# EAGLE design micShield (EAGLE 8.7.1)

## Sheet 1 of 2
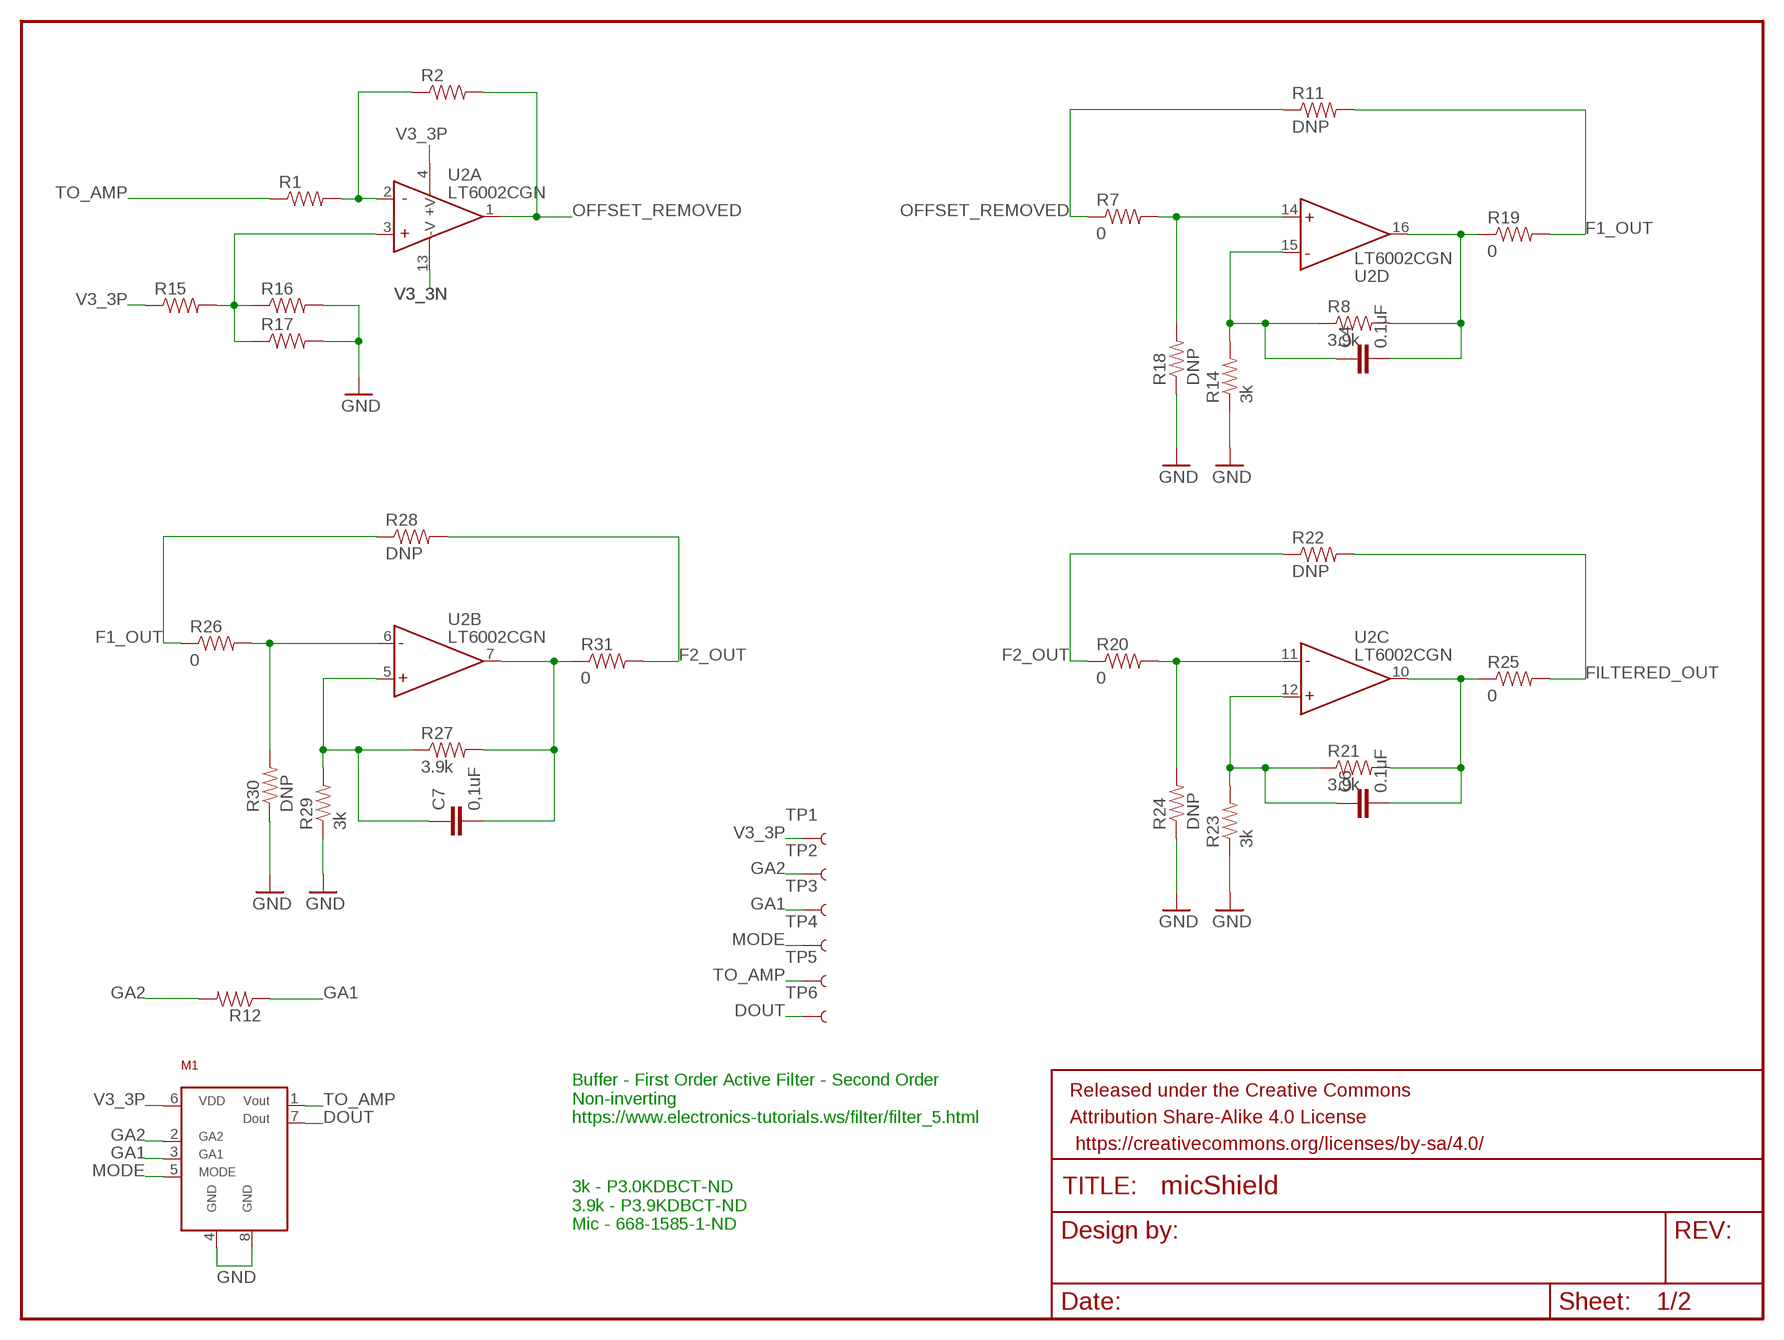
[diagram p0: schematic, sheet 1]

### Parts
C4  0.1uF  CAP0402-CAP  [0402-CAP]
C6  0.1uF  CAP0402-CAP  [0402-CAP]
C7  0,1uF  CAP0402-CAP  [0402-CAP]
FRAME1  FRAME-LETTER  [CREATIVE_COMMONS]
M1  PMM-3738-VM1010-R  [PMM-3738-VM1010-R]
R1  RESISTOR0402  [0402-RES]
R2  RESISTOR0402  [0402-RES]
R7  0  RESISTOR0402  [0402-RES]
R8  3.9k  RESISTOR0402  [0402-RES]
R11  DNP  RESISTOR0402  [0402-RES]
R12  RESISTOR0402  [0402-RES]
R14  3k  RESISTOR0402  [0402-RES]
R15  RESISTOR0402  [0402-RES]
R16  RESISTOR0402  [0402-RES]
R17  RESISTOR0402  [0402-RES]
R18  DNP  RESISTOR0402  [0402-RES]
R19  0  RESISTOR0402  [0402-RES]
R20  0  RESISTOR0402  [0402-RES]
R21  3.9k  RESISTOR0402  [0402-RES]
R22  DNP  RESISTOR0402  [0402-RES]
R23  3k  RESISTOR0402  [0402-RES]
R24  DNP  RESISTOR0402  [0402-RES]
R25  0  RESISTOR0402  [0402-RES]
R26  0  RESISTOR0402  [0402-RES]
R27  3.9k  RESISTOR0402  [0402-RES]
R28  DNP  RESISTOR0402  [0402-RES]
R29  3k  RESISTOR0402  [0402-RES]
R30  DNP  RESISTOR0402  [0402-RES]
R31  0  RESISTOR0402  [0402-RES]
TP1  TEST-POINT3  [PAD.03X.03]
TP2  TEST-POINT3  [PAD.03X.03]
TP3  TEST-POINT3  [PAD.03X.03]
TP4  TEST-POINT3  [PAD.03X.03]
TP5  TEST-POINT3  [PAD.03X.03]
TP6  TEST-POINT3  [PAD.03X.03]
U2  LT6002CGN  [SSOP-16_GN]

### Nets
DOUT: M1.7 TP6.P$1 ; also sheet 2
F1_OUT: R11.2 R19.2 R26.1 R28.1
F2_OUT: R20.1 R22.1 R28.2 R31.2
FILTERED_OUT: R22.2 R25.2 ; also sheet 2
GA1: M1.3 R12.1 TP3.P$1
GA2: M1.2 R12.2 TP2.P$1
GND: M1.4 M1.8 R14.1 R16.2 R17.2 R18.1 R23.1 R24.1 R29.1 R30.1 ; also sheet 2
MODE: M1.5 TP4.P$1 ; also sheet 2
N$1: R1.2 R2.1 U2.2(A:-IN)
N$6: R15.2 R16.1 R17.1 U2.3(A:+IN)
N$7: C4.1 R8.1 R14.2 U2.15(D:-IN)
N$9: R7.2 R18.2 U2.14(D:+IN)
N$10: C4.2 R8.2 R19.1 U2.16(D:OUT)
N$12: R20.2 R24.2 U2.11(C:-IN)
N$13: C6.1 R21.1 R23.2 U2.12(C:+IN)
N$14: C6.2 R21.2 R25.1 U2.10(C:OUT)
N$16: R26.2 R30.2 U2.6(B:-IN)
N$17: C7.1 R27.1 R29.2 U2.5(B:+IN)
N$18: C7.2 R27.2 R31.1 U2.7(B:OUT)
OFFSET_REMOVED: R2.2 R7.1 R11.1 U2.1(A:OUT)
TO_AMP: M1.1 R1.1 TP5.P$1
V3_3N: U2.13(A:-V) ; also sheet 2
V3_3P: M1.6 R15.1 TP1.P$1 U2.4(A:+V) ; also sheet 2

### Notes on the sheet
- Buffer - First Order Active Filter - Second Order 
  Non-inverting
  https://www.electronics-tutorials.ws/filter/filter_5.html
- 3k - P3.0KDBCT-ND
  3.9k - P3.9KDBCT-ND
  Mic - 668-1585-1-ND

## Sheet 2 of 2
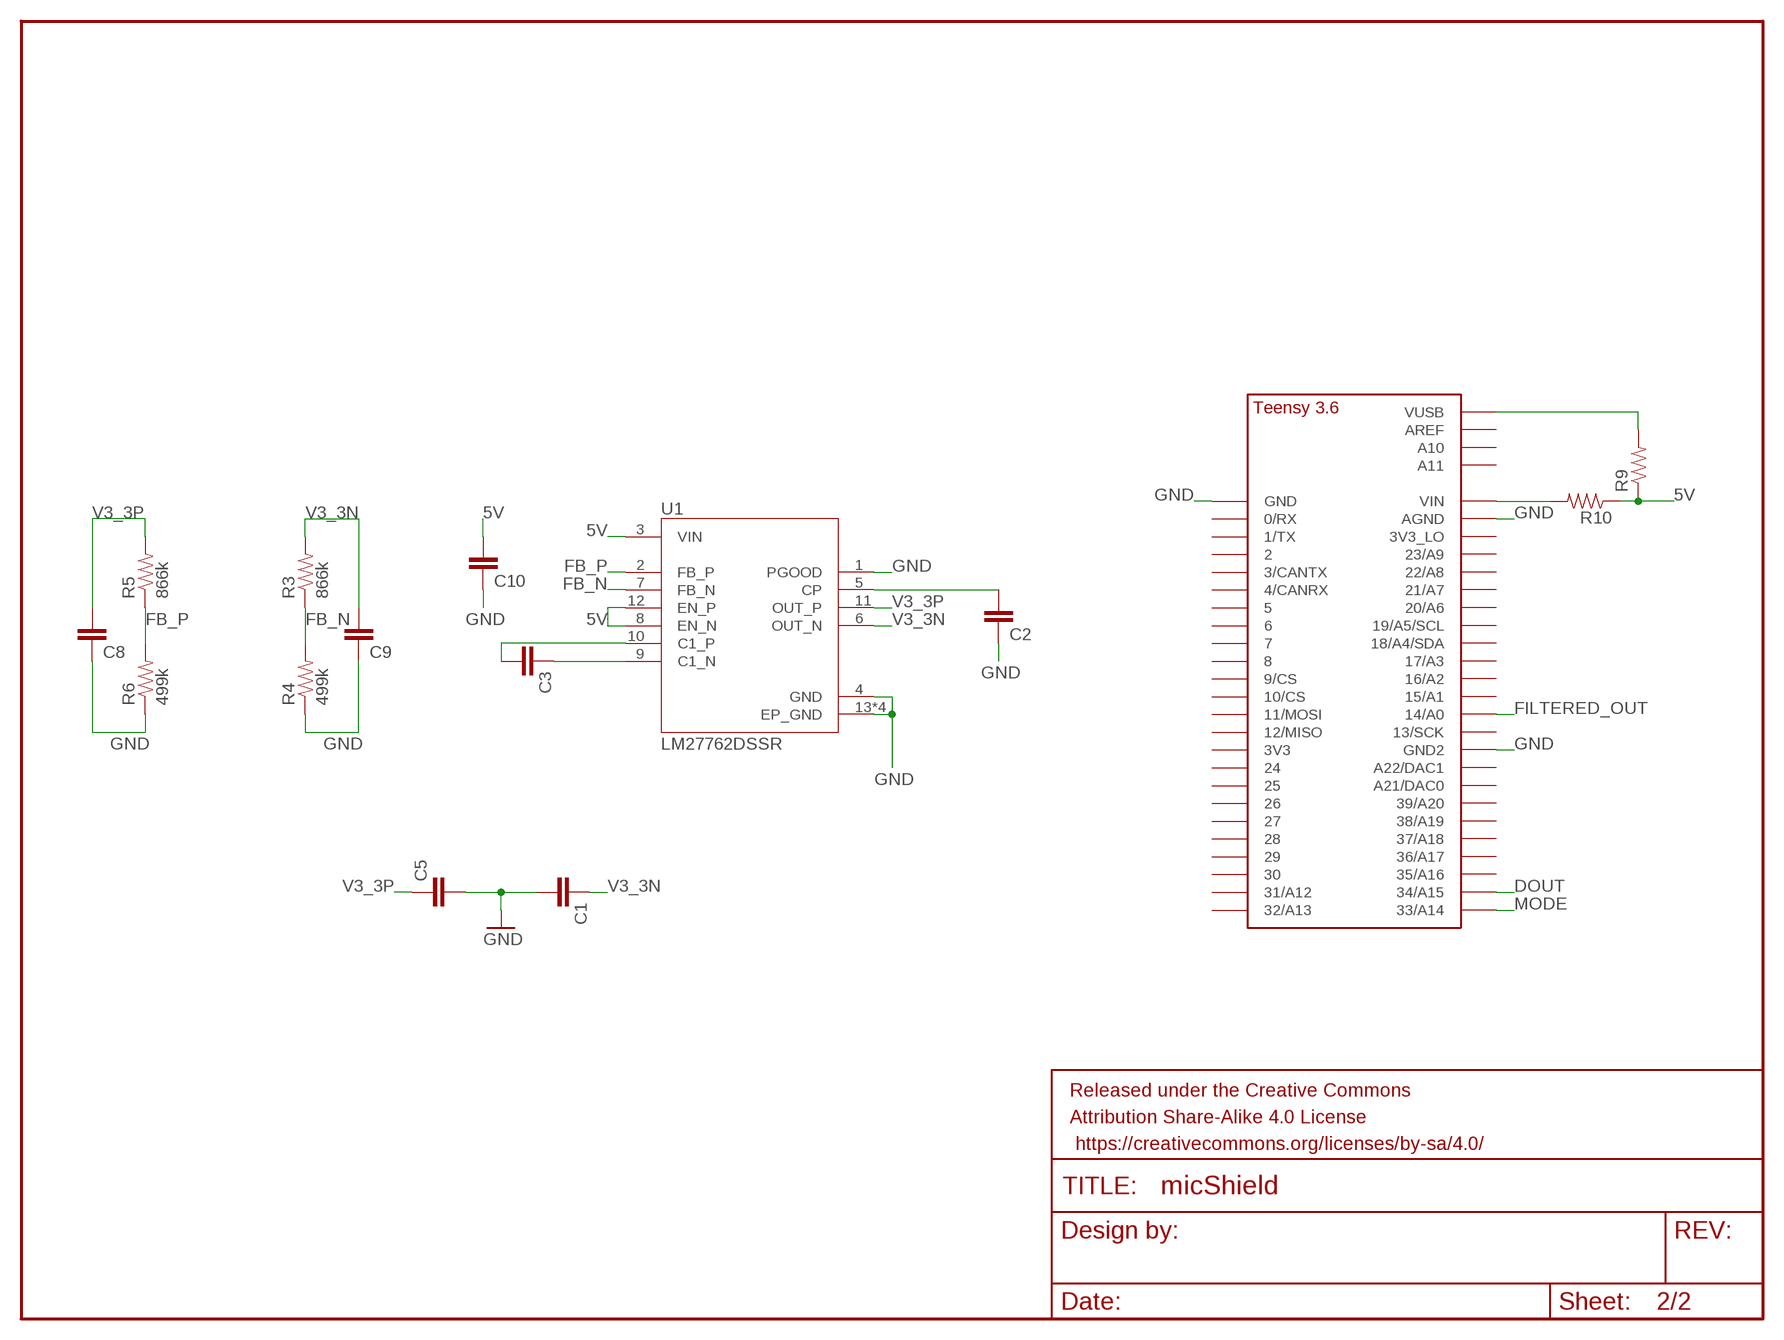
[diagram p1: schematic, sheet 2]

### Parts
C1  CAP0603-CAP  [0603-CAP]
C2  CAP0603-CAP  [0603-CAP]
C3  CAP0402-CAP  [0402-CAP]
C5  CAP0603-CAP  [0603-CAP]
C8  CAP0603-CAP  [0603-CAP]
C9  CAP0603-CAP  [0603-CAP]
C10  CAP0603-CAP  [0603-CAP]
FRAME2  FRAME-LETTER  [CREATIVE_COMMONS]
R3  866k  RESISTOR0402  [0402-RES]
R4  499k  RESISTOR0402  [0402-RES]
R5  866k  RESISTOR0402  [0402-RES]
R6  499k  RESISTOR0402  [0402-RES]
R9  RESISTOR0402  [0402-RES]
R10  RESISTOR0402  [0402-RES]
U1  LM27762DSSR  [VREG_LM27762DSSR]
U$1  TEENSY_3.5/3.6_BASIC  [TEENSY_3.5/3.6_BASIC]

### Nets
5V: C10.2 R9.1 R10.1 U1.3(VIN) U1.8(EN_N) U1.12(EN_P)
DOUT: U$1.34/A15 ; also sheet 1
FB_N: R3.1 R4.2 U1.7(FB_N)
FB_P: R5.1 R6.2 U1.2(FB_P)
FILTERED_OUT: U$1.14/A0 ; also sheet 1
GND: C1.2 C2.1 C5.2 C8.1 C9.1 C10.1 R4.1 R6.1 U1.1(PGOOD) U1.4(GND) U1.13(EP_GND) U1.13.1(EP_GND) U1.13.2(EP_GND) U1.13.3(EP_GND) U$1.AGND U$1.GND U$1.GND2 ; also sheet 1
MODE: U$1.33/A14 ; also sheet 1
N$2: C2.2 U1.5(CP)
N$3: C3.1 U1.9(C1_N)
N$4: C3.2 U1.10(C1_P)
N$5: R9.2 U$1.VUSB
N$11: R10.2 U$1.VIN
V3_3N: C1.1 C9.2 R3.2 U1.6(OUT_N) ; also sheet 1
V3_3P: C5.1 C8.2 R5.2 U1.11(OUT_P) ; also sheet 1
Unconnected: U$1.0/RX U$1.1/TX U$1.2 U$1.3/CANTX U$1.3V3 U$1.3V3_LO U$1.4/CANRX U$1.5 U$1.6 U$1.7 U$1.8 U$1.9/CS U$1.10/CS U$1.11/MOSI U$1.12/MISO U$1.13/SCK U$1.15/A1 U$1.16/A2 U$1.17/A3 U$1.18/A4/SDA U$1.19/A5/SCL U$1.20/A6 U$1.21/A7 U$1.21/DAC0(A21/DAC0) U$1.22/A8 U$1.23/A9 U$1.24 U$1.25 U$1.26 U$1.27 U$1.28 U$1.29 U$1.30 U$1.31/A12 U$1.32/A13 U$1.35/A16 U$1.36/A17 U$1.37/A18 U$1.38/A19 U$1.39/A20 U$1.A10 U$1.A11 U$1.A22/DAC1 U$1.AREF

## Library data of the parts
C1-C10 = SparkFun-Capacitors:CAP: Capacitor Standard 0603 ceramic capacitor, and 0.1" leaded capacitor.
FRAME1 FRAME2 = SparkFun-Aesthetics:FRAME-LETTER: Schematic Frame Standard 8.5x11 US Letter frame
M1 = MIC:PMM-3738-VM1010-R: PUI Audio - PMM-3738-VM1010-R Datasheet <http://www.puiaudio.com/pdf/PMM-3738-VM1010-R.pdf>
R1-R12 R14-R31 = SparkFun-Resistors:RESISTOR: Resistor Basic schematic elements and footprints for 0603, 1206, and PTH resistors.
TP1-TP6 = SparkFun-Passives:TEST-POINT: Bare copper test points for troubleshooting or ICT
U1 = LM27762DSSR:LM27762DSSR: Low-Noise Positive- and Negative-Output Charge Pump With Integrated LDO 12-WSON -40 to 85; AVAILABILITY: Good; DESCRIPTION: Low-Noise Positive- and Negative-Output Charge Pump With Integrated LDO 12-WSON -40 to 85; MF: Texas Instruments; MP: LM27762DSSR; PACKAGE: WSON-12 Texas Instruments; PRICE: 1.31 USD
U2 = LT6002:LT6002CGN; MANUFACTURER_PART_NUMBER: LT6002CGN#PBF; VENDOR: Linear Technology
U$1 = Teensy356:TEENSY_3.5/3.6_BASIC

## Board
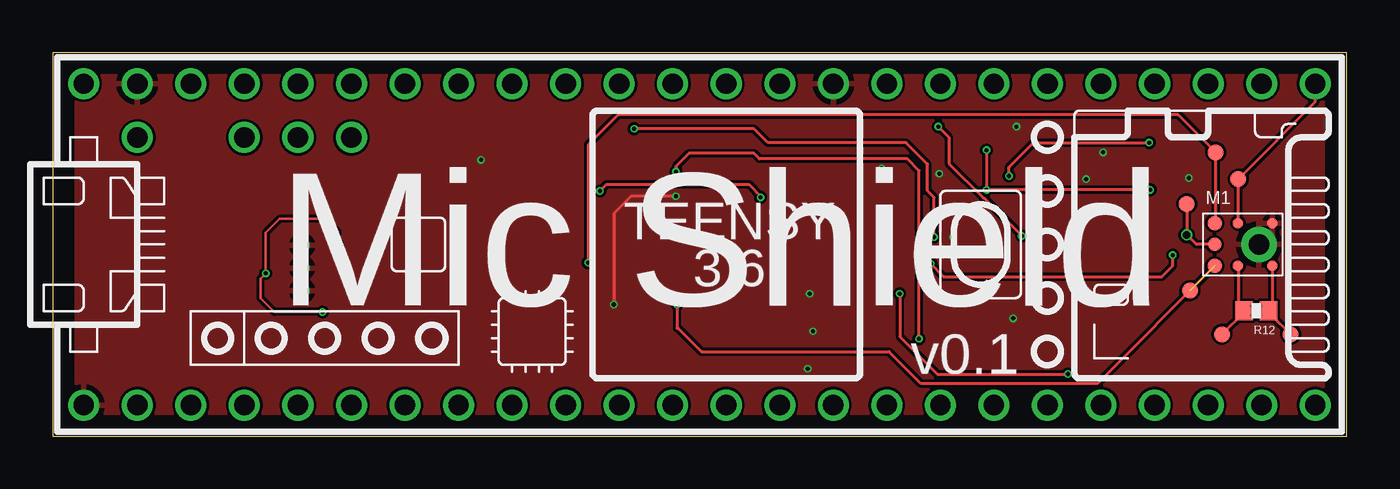
[diagram p2: board, top side]
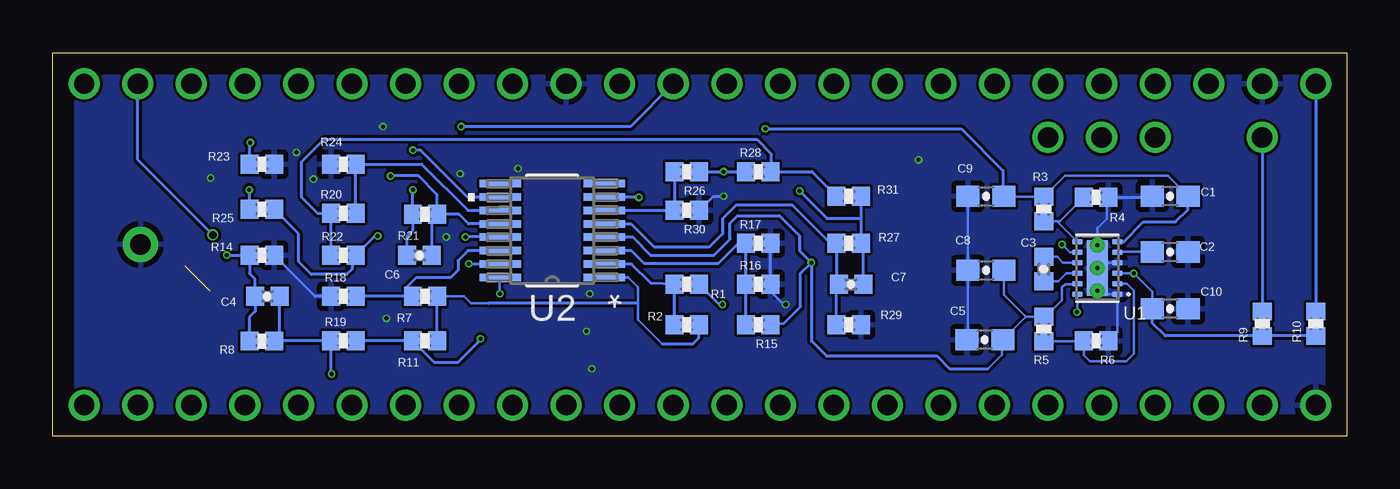
[diagram p3: board, bottom side, seen from below]

Size 61.39 x 18.19 mm. Coordinates in mm from the lower left corner, seen from the top.
Outline: 0,0 61.39,0 61.39,18.19 0,18.19 0,0
Copper layers (1*16): Top 0.035mm / dielectric 1.5mm / Bottom 0.035mm
Design rules "jlcpcb-dru *": minimum track width 5mil, minimum drill 0.2mm, track to track 5mil, track to pad 5mil, pad to pad 5mil, via to via 5mil, smd to smd 5mil, copper to edge 40mil, drill to drill 8mil, minimum pad ring 10mil, minimum via ring 3mil, stop-mask expansion 4mil, vias tented up to drill 0mil, thermal gap 10mil

### Footprints (pad centres in the part's own frame; a part is rotated, then mirrored left to right if it is on the bottom)
0603-CAP = smd 1.1 x 1: 1 -0.85,0; 2 0.85,0
0402-CAP = smd 0.85 x 0.9: 1 -0.58,0; 2 0.58,0
PMM-3738-VM1010-R = smd 0.7 x 0.7 bottom: 1 2.1,-1.015; 6 2.1,1.015 | smd 0.5 x 0.5 bottom: 2 1,-1.015; 5 1,1.015 | smd 0.49 x 0.49 bottom: 3 -0.64,-1.015; 4 -0.64,1.015 | smd 0.65 x 0.65 bottom: 7 2.1,0 | drill 0.96 pad 1.68: 8 0,0
0402-RES = smd 0.85 x 0.9: 1 -0.58,0; 2 0.58,0
PAD.03X.03 = smd 0.762 x 0.762: P$1 0,0
VREG_LM27762DSSR = smd 0.5 x 0.25: 1 -0.95,1.25; 2 -0.95,0.75; 3 -0.95,0.25; 4 -0.95,-0.25; 5 -0.95,-0.75; 6 -0.95,-1.25; 7 0.95,-1.25; 8 0.95,-0.75; 9 0.95,-0.25; 10 0.95,0.25; 11 0.95,0.75; 12 0.95,1.25 | smd 1 x 2.65: 13 0,0 | drill 0.2 pad 0.35: 13.1 0,1.075; 13.2 0,0; 13.3 0,-1.075
SSOP-16_GN = smd 1.981 x 0.356: 1 -2.464,2.223; 2 -2.464,1.587; 3 -2.464,0.953; 4 -2.464,0.318; 5 -2.464,-0.318; 6 -2.464,-0.953; 7 -2.464,-1.587; 8 -2.464,-2.223; 9 2.464,-2.223; 10 2.464,-1.587; 11 2.464,-0.953; 12 2.464,-0.318; 13 2.464,0.318; 14 2.464,0.953; 15 2.464,1.587; 16 2.464,2.223
TEENSY_3.5/3.6_BASIC = drill 0.965: 0/RX -25.4,-7.62; 1/TX -22.86,-7.62; 2 -20.32,-7.62; 3/CANTX -17.78,-7.62; 3V3 7.62,-7.62; 3V3_LO -22.86,7.62; 4/CANRX -15.24,-7.62; 5 -12.7,-7.62; 6 -10.16,-7.62; 7 -7.62,-7.62; 8 -5.08,-7.62; 9/CS -2.54,-7.62; 10/CS 0,-7.62; 11/MOSI 2.54,-7.62; 12/MISO 5.08,-7.62; 13/SCK 5.08,7.62; 14/A0 2.54,7.62; 15/A1 0,7.62; 16/A2 -2.54,7.62; 17/A3 -5.08,7.62; 18/A4/SDA -7.62,7.62; 19/A5/SCL -10.16,7.62; 20/A6 -12.7,7.62; 21/A7 -15.24,7.62; 21/DAC0 12.7,7.62; 22/A8 -17.78,7.62; 23/A9 -20.32,7.62; 24 10.16,-7.62; 25 12.7,-7.62; 26 15.24,-7.62; 27 17.78,-7.62; 28 20.32,-7.62; 29 22.86,-7.62; 30 25.4,-7.62; 31/A12 27.94,-7.62; 32/A13 30.48,-7.62; 33/A14 30.48,7.62; 34/A15 27.94,7.62; 35/A16 25.4,7.62; 36/A17 22.86,7.62; 37/A18 20.32,7.62; 38/A19 17.78,7.62; 39/A20 15.24,7.62; A10 -17.78,5.08; A11 -15.24,5.08; A22/DAC1 10.16,7.62; AGND -25.4,7.62; AREF -20.32,5.08; GND -27.94,-7.62; GND2 7.62,7.62; VIN -27.94,7.62; VUSB -25.4,5.08

### Placement (x,y rotation side)
C1  8.38,11.38 180 bottom
C2  8.38,8.74 180 bottom
C3  14.38,7.92 270 bottom
C4  51.21,6.63 0 bottom
C5  17.17,4.57 180 bottom
C6  43.99,8.57 180 bottom
C7  23.52,7.2 0 bottom
C8  17.12,7.87 0 bottom
C9  17.12,11.38 0 bottom
C10  8.38,6.05 180 bottom
FRAME1  -7.92,-7.92 0 top  (outside the outline)
FRAME2  -6.91,-6.91 0 top  (outside the outline)
M1  57.23,9.09 0 bottom
R1  31.32,7.2 180 bottom
R2  31.32,5.28 0 bottom
R3  14.38,10.77 90 bottom
R4  11.89,11.33 180 bottom
R5  14.38,5.08 90 bottom
R6  11.89,4.52 180 bottom
R7  43.73,6.63 180 bottom
R8  51.47,4.51 0 bottom
R9  4.01,5.33 90 bottom
R10  1.47,5.33 90 bottom
R11  43.73,4.52 180 bottom
R12  57.1,5.94 180 top
R14  51.47,8.57 180 bottom
R15  27.91,5.28 180 bottom
R16  27.91,7.2 0 bottom
R17  27.91,9.14 0 bottom
R18  47.6,6.63 0 bottom
R19  47.6,4.52 0 bottom
R20  47.6,10.57 0 bottom
R21  43.73,10.52 180 bottom
R22  47.6,8.57 0 bottom
R23  51.46,12.9 180 bottom
R24  47.6,12.9 0 bottom
R25  51.47,10.77 0 bottom
R26  31.32,12.55 180 bottom
R27  23.62,9.14 0 bottom
R28  27.91,12.55 0 bottom
R29  23.62,5.28 180 bottom
R30  31.32,10.72 180 bottom
R31  23.62,11.38 180 bottom
TP1  55.17,13.46 0 top
TP2  55.47,4.83 0 top
TP3  58.72,4.83 0 top
TP4  56.24,12.19 0 top
TP5  53.95,6.91 0 top
TP6  53.8,11.02 0 top
U1  11.84,7.98 180 bottom
U2  37.69,9.75 180 bottom
U$1  29.41,9.09 0 top

### Tracks (layer width: path | path; a pad name or v marks a point on that pad's centre or on a via)
5V  (via drill 0.2)
  Top 0.127: v13.51,9.09 13.51,9.7 12.9,10.31 10.77,10.31 10.11,9.65 v10.11,7.72 9.85,7.47 9.85,6.55 10.52,5.89 v12.8,5.89
  Bottom 0.127: U1.8 13.14,8.73 v13.51,9.09 | U1.3 v10.11,7.72 9.23,6.84 C10.2 | U1.12 12.79,5.91 v12.8,5.89
  Bottom 0.152: R10.1 R9.1 8.61,4.75 9.25,5.38 9.23,5.4 C10.2
DOUT  (via drill 0.35)
  Top 0.152: M1.7 54.25,9.09 v53.8,9.55 TP6.P$1
  Bottom 0.152: v53.8,9.55 57.35,13.11 U$1.34/A15
F1_OUT  (via drill 0.2)
  Top 0.152: v41.1,4.62 41.1,12.6 40.54,13.16 33.53,13.16 33.27,13.41 30.17,13.41 29.57,12.8 v29.57,12.55
  Bottom 0.152: R19.2 R11.2 43.77,3.99 43.29,3.51 42.16,3.51 41.05,4.62 v41.1,4.62 | R26.1 v29.57,12.55 R28.1
F2_OUT
  Bottom 0.152: R22.1 R20.1 48.82,10.57 49.58,11.33 49.58,13 48.51,14.07 27.99,14.07 27.31,13.39 R28.2 25.37,12.55 R31.2
FB_N
  Bottom 0.127: R4.2 13.61,10.19 13.75,10.19 | 13.75,10.19 R3.1 | U1.7 13.75,10.19
FB_P
  Bottom 0.127: U1.2 10.43,7.23 10.11,6.91 10.11,3.91 10.46,3.56 12.19,3.56 12.47,3.83 R6.2 12.49,4.5 R5.1
FILTERED_OUT  (via drill 0.2)
  Top 0.152: v42.01,14.68 42.52,14.17 42.52,12.93 44.14,11.3 44.17,11.3 v45.97,9.5
  Bottom 0.152: R22.2 47.19,8.46 | R22.2 47.19,8.4 47.19,7.92 47.45,7.67 49.12,7.67 49.73,8.28 49.73,9.6 50.89,10.76 R25.2 | U$1.14/A0 33.98,14.68 v42.01,14.68 | v45.97,9.5 46.09,9.5 R22.2
GA1
  Top 0.152: M1.3 57.86,5.94 | 57.86,5.94 57.89,6.16 R12.1 | TP3.P$1 57.86,5.69 57.86,5.94
GA2
  Top 0.152: M1.2 56.24,6.1 56.25,6.21 R12.2 56.52,5.87 TP2.P$1
GND  (via drill 0.2)
  Top 0.152: v29.57,11.38 27.43,11.38 26.62,10.57 v26.62,6.25
  Bottom 0.127: R4.1 11.38,11.26 11.38,10.31 11.84,9.86 U1.13.3 U1.13.2 | U1.13.2 U1.13.1 11.66,6.73 U1.1 10.89,4.94 R6.1 | U1.4 11.59,8.23 U1.13.2 | C5.2 17.97,4.62 C8.1 C9.1
  Bottom 0.152: R17.2 R16.2 27.36,6.89 26.72,6.25 v26.62,6.25 | R18.1 48.95,6.63 R14.1 | R30.1 30.05,11.38 v29.57,11.38 | R4.1 9.28,11.33 C1.2
  other vias: 53.9,12.24 45.72,14.68 45.57,5.59 36.07,4.98 35.92,6.76 20.32,13.11 42.06,12.45 39.32,12.7 42.72,9.45 35.81,3.2 49.02,12.19 49.83,13.46
  pour Top: -2.59,19.66 63.3,19.66 63.3,-1.52 -2.59,-1.52
  pour Bottom: -3.25,20.42 64.01,20.42 64.01,-2.39 -3.25,-2.39
MODE
  Top 0.152: M1.5 TP4.P$1 59.89,15.85 U$1.33/A14
N$1
  Bottom 0.152: R2.1 R1.2 33,7.25 33.92,8.17 U2.2
N$2
  Bottom 0.127: C2.2 10.87,8.74 U1.5
N$3
  Bottom 0.127: U1.9 13.46,8.23 13.74,8.5 C3.1
N$4
  Bottom 0.127: U1.10 13.31,7.73 13.69,7.34 C3.2
N$5
  Bottom 0.152: U$1.VUSB R9.2
N$6
  Bottom 0.152: R15.2 R16.1 R17.1 28.85,9.14 29.82,8.18 33.32,8.18 33.93,8.79 35.22,8.79 U2.3
N$7  (via drill 0.2)
  Top 0.152: v41.66,8.18 42.27,7.57 52.63,7.57 53.14,8.08 v53.14,8.59
  Bottom 0.152: U2.15 41.64,8.17 v41.66,8.18 | R8.1 52.07,4.53 52.07,5.64 51.79,5.92 C4.1 51.82,6.66 51.82,7.47 52.05,7.7 52.05,8.53 | R14.2 52.05,8.53 | v53.14,8.59 52.1,8.59 52.05,8.53
N$9
  Bottom 0.152: U2.14 41.69,8.8 42.16,8.33 42.16,7.87 42.52,7.52 44.14,7.52 44.61,7.05 R7.2 R18.2
N$10  (via drill 0.2)
  Top 0.152: v40.18,6.76 40.18,4.72 41.96,2.95 v48.16,2.95
  Bottom 0.127: v40.18,6.76 40.18,7.51 U2.16
  Bottom 0.152: 50.62,6.84 C4.2 50.63,4.78 R8.2 50.62,4.52 R19.1 48.18,2.97 v48.16,2.95 | 40.18,6.81 v40.18,6.76
N$11
  Bottom 0.152: U$1.VIN R10.2
N$12
  Bottom 0.152: R20.2 R24.2 43.89,12.9 41.69,10.71 U2.11
N$13  (via drill 0.2)
  Top 0.152: v45.36,12.34 45.36,12.75 46.53,13.92 v52.02,13.92
  Bottom 0.152: U2.12 41.67,10.07 42.11,10.52 R21.1 | R21.1 43.41,10.25 C6.1 | R21.1 43.15,11.45 44.04,12.34 v45.36,12.34 45.41,12.34 | R23.2 52.04,13.9 v52.02,13.92
N$14  (via drill 0.2)
  Top 0.152: v44.3,13.56 v44.3,11.68 v52.07,11.68
  Bottom 0.152: U2.10 41.72,11.34 | 41.72,11.34 41.71,11.33 | 41.72,11.34 43.94,13.56 v44.3,13.56 | 44.64,8.64 C6.2 44.6,8.6 44.6,9.45 44.31,9.74 R21.2 v44.31,11.68 v44.3,11.68 | R25.1 52.05,11.67 v52.07,11.68
N$16
  Bottom 0.152: R26.2 R30.2 31.89,10.71 U2.6
N$17
  Bottom 0.152: 24.2,7.32 R27.1 24.69,9.35 26.31,10.97 28.96,10.97 29.62,10.31 29.62,9.6 30.23,8.99 32.87,8.99 33.95,10.07 U2.5 | 24.2,7.32 C7.1 | R29.2 24.2,7.32
N$18  (via drill 0.2)
  Top 0.152: v25.96,11.63 26.26,11.94 33.02,11.94 33.58,11.38 v33.58,11.33
  Bottom 0.152: R27.2 23.04,9.6 | C7.2 22.94,9.5 23.04,9.6 | R31.1 23.04,10.31 | 23.04,10.31 23.04,9.6 | 23.04,10.31 24.64,10.31 v25.96,11.63 | v33.58,11.33 33.59,11.34 U2.7
OFFSET_REMOVED
  Bottom 0.127: 40.74,6.3 41.55,6.3 41.88,6.63 R7.1 | 34.1,7.53 33.63,7.06 33.63,6.3 33.63,5.53 32.46,4.37
  Bottom 0.152: R11.1 R7.1 | 33.63,6.3 40.74,6.3 | 32.46,4.37 31.04,4.37 30.73,4.67 30.74,4.68 R2.2 | U2.1 34.1,7.53
TO_AMP  (via drill 0.2)  (1 unrouted)
  Top 0.152: M1.1 49.56,2.49 41.2,2.49 39.67,4.01 30.78,4.01 29.67,5.13 29.62,5.13 v29.62,6.25
  Bottom 0.152: v29.62,6.25 29.78,6.25 R1.1
V3_3N  (via drill 0.2)
  Top 0.152: v41.81,9.45 41.81,11.33 41.5,11.63 41.5,12.9 40.49,13.92 33.93,13.92 33.27,14.58 v27.58,14.58
  Bottom 0.127: C9.2 16.6,11.35 16.31,11.35 R3.2 13.38,12.34 8.5,12.34 C1.1
  Bottom 0.152: U2.13 40.17,9.45 v41.81,9.45 | U1.6 10.59,9.23 9.65,10.16 8.13,10.16 7.52,10.77 7.53,10.78 C1.1 | C9.2 16.26,11.39 | v27.58,14.58 18.29,14.58 16.31,12.6 16.31,11.35
V3_3P  (via drill 0.2)
  Top 0.152: M1.6 55.17,10.11 TP1.P$1 53.39,15.24 26.82,15.24 25.4,13.82 v25.4,8.23
  Bottom 0.127: U1.11 12.8,7.21 13.36,7.21 13.51,7.06 13.51,6.45 14.3,5.66 R5.2 15.23,5.66 | 15.23,5.66 C5.1 16.36,4.53 16.36,3.86 17.02,3.2 | 15.23,5.66 16.27,6.7 C8.2
  Bottom 0.152: U2.4 35.22,9.45 33.88,9.45 33.02,8.59 30.02,8.59 29.26,9.35 29.26,10.11 28.9,10.46 26.92,10.46 25.96,9.5 25.96,8.79 v25.4,8.23 | R15.1 26.72,5.33 25.91,6.15 25.91,7.72 v25.4,8.23 | v25.4,8.23 25.4,4.52 24.69,3.81 19.46,3.81 18.85,3.2 17.02,3.2

### Text on the board
tNames: Mic Shield | v0.1